# Altium schematic sheet Sheet1.SchDoc
size A; SheetNumber: 1; SheetTotal: 1
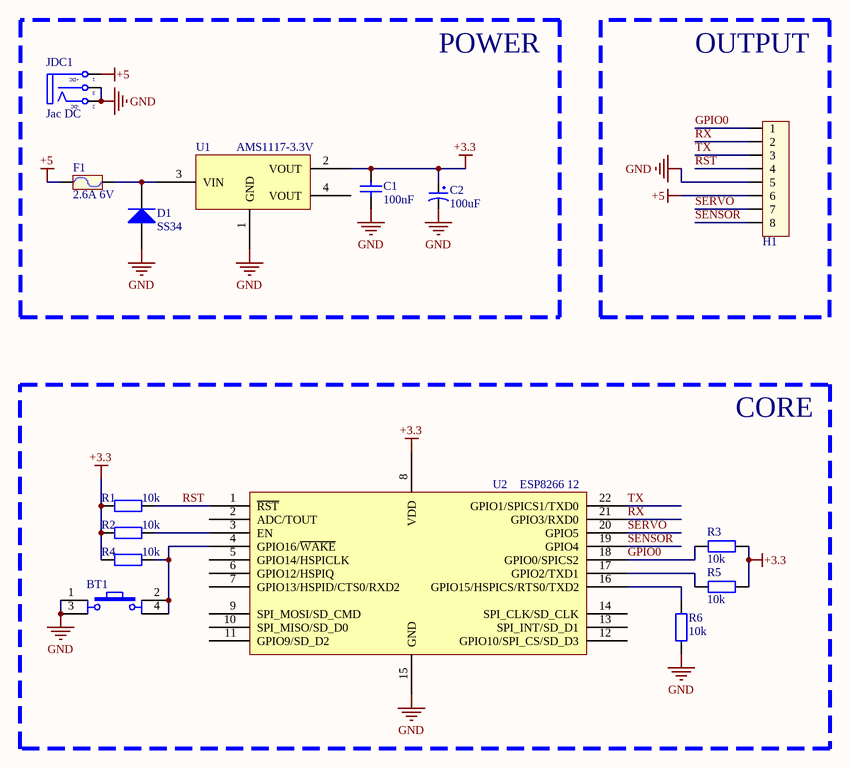
[diagram p0: Sheet1.SchDoc]

## Parts
BT1  Nut Nhan 4 Chan SMD 6x6  [Nut Nhan 4 Chan SMD 6x6]  (value not drawn)
C1  100nF  [tu 0805]
C2  100uF  [tu tantalum smd3528]
D1  SS34  [DIODE SMA]
F1  2.6A 6V  [Cau chi tu phuc hoi 2A 24V SMD1812]
H1  Header 8P 2.54 Duc Thang  [XH2.54M-8]  (value not drawn)
JDC1  Jac DC  [DC0]
R1  10k  [tro smd 0805]
R2  10k  [tro smd 0805]
R3  10k  [tro smd 0805]
R4  10k  [tro smd 0805]
R5  10k  [tro smd 0805]
R6  10k  [tro smd 0805]
U1  AMS1117-3.3V  [SOT223]
U2  ESP8266 12  [ESP8266 12]

## Blocks framed on the sheet
POWER: C1 C2 D1 F1 JDC1 U1
OUTPUT: H1
CORE: BT1 R1-R6 U2

## Nets
+3.3: C1.1 C2.1 R1.2 R2.2 R3.2 R4.2 R5.2 U1.2(VOUT) U2.8(VDD)
+5: F1.2 H1.6 JDC1.1(T)
GND: BT1.1 BT1.3 C1.2 C2.2 D1.1(A) H1.5 JDC1.2(TN) JDC1.3(S) R6.1 U1.1(GND) U2.15(GND)
GPIO0: H1.1 R3.1 U2.18(GPIO0/SPICS2)
RST: H1.4 R1.1 U2.1(~{RST})
RX: H1.2 U2.21(GPIO3/RXD0)
SENSOR: H1.8 U2.19(GPIO4)
SERVO: H1.7 U2.20(GPIO5)
TX: H1.3 U2.22(GPIO1/SPICS1/TXD0)
NetBT1_2: BT1.2 BT1.4 R4.1 U2.4(GPIO16/~{WAKE})
NetD1_2: D1.2(K) F1.1 U1.3(VIN)
NetR2_1: R2.1 U2.3(EN)
NetR5_1: R5.1 U2.17(GPIO2/TXD1)
NetR6_2: R6.2 U2.16(GPIO15/HSPICS/RTS0/TXD2)

Not connected (* = marked no-connect by the designer): U1 4(VOUT); U2 2(ADC/TOUT) 5(GPIO14/HSPICLK) 6(GPIO12/HSPIQ) 7(GPIO13/HSPID/CTS0/RXD2) 9(SPI_MOSI/SD_CMD) 10(SPI_MISO/SD_D0) 11(GPIO9/SD_D2) 12(GPIO10/SPI_CS/SD_D3) 13(SPI_INT/SD_D1) 14(SPI_CLK/SD_CLK)

## Notes on the sheet
- (in symbol DCIN) +DC; -DC

## Library data of the parts
BT1 = Nut Nhan 4 Chan SMD 6x6: Nut Nhan 4 Chan 6.2x6.2x3.5; Ten: Nút Nhấn 4 Chân 6.2x6.2x3.1MM SMD; Ma_Hang: MH002424
C1 = Tu 0805 221 50V: Dán; Don_Vi: Con; So_Chan: 2; Ten_Linh_Kien: Tụ 0805 221-220P 50V; Ma_Hang: MH007365; Chung_Loai: Dán; Kieu_Chan: *
C2 = Tu tantalum 100uF 6.3V SMD3528: Tu Tantalum SMD3528; Chung_Loai: Dán; Don_Vi: Con; So_Chan: 2; Ten_Linh_Kien: Tụ tantalum 107J-100uF 6.3V SMD3528; Ma_Hang: MH007595; Kieu_Chan: *
D1 = Diode SS34 ( 1N5822 ): Dán; Don_Vi: Con; Ma_Hang: MH002104; Ten_Linh_Kien: Diode SS34 3A 40V SMA ( 1N5822 SS34A); Kieu_Chan: *; Chung_Loai: Dán
F1 = Cau chi tu phuc hoi 2A 24V SMD1812: https://linhkienchatluong.vn/cau-chi-tu-phuc-hoi-ptc/cau-chi-tu-phuc-hoi-1812-26a-6v-smd-2xx260f_sp845_ct1259.aspx; Ma_Hang: MH010033; Ten: Cầu Chì Tự Phục Hồi 2A 24V SMD1812
H1 = Header 8P 2.54 Duc Thang: Cắm; Ten_Linh_Kien: Header 8P XH2.54-8P Đực Thẳng; Don_Vi: Con; Ma_Hang: MH003366; Chung_Loai: Cắm
JDC1 = DCIN: Jac DC input; Value: Jac DC
R1-R6 = Tro 0805 5% 12k: Dán; Don_Vi: Con; So_Chan: 2; Ten_Linh_Kien: Trở 0805 5% 12k; Ma_Hang: MH005241; Chung_Loai: Dán; Kieu_Chan: *
U1 = AMS1117 SMD: Dán; Value: AMS1117-3.3V SOT223; Don_Vi: Con; Ma_Hang: MH000596; Ghi_Chu: *; Kieu_Chan: *; Chung_Loai: Dán
U2 = ESP8266 12: ESP8266 12 22 Pin; IC: ESP8266-EX; Vendor: Ai-thinker